# EAGLE design picduino2b (EAGLE 5.06)
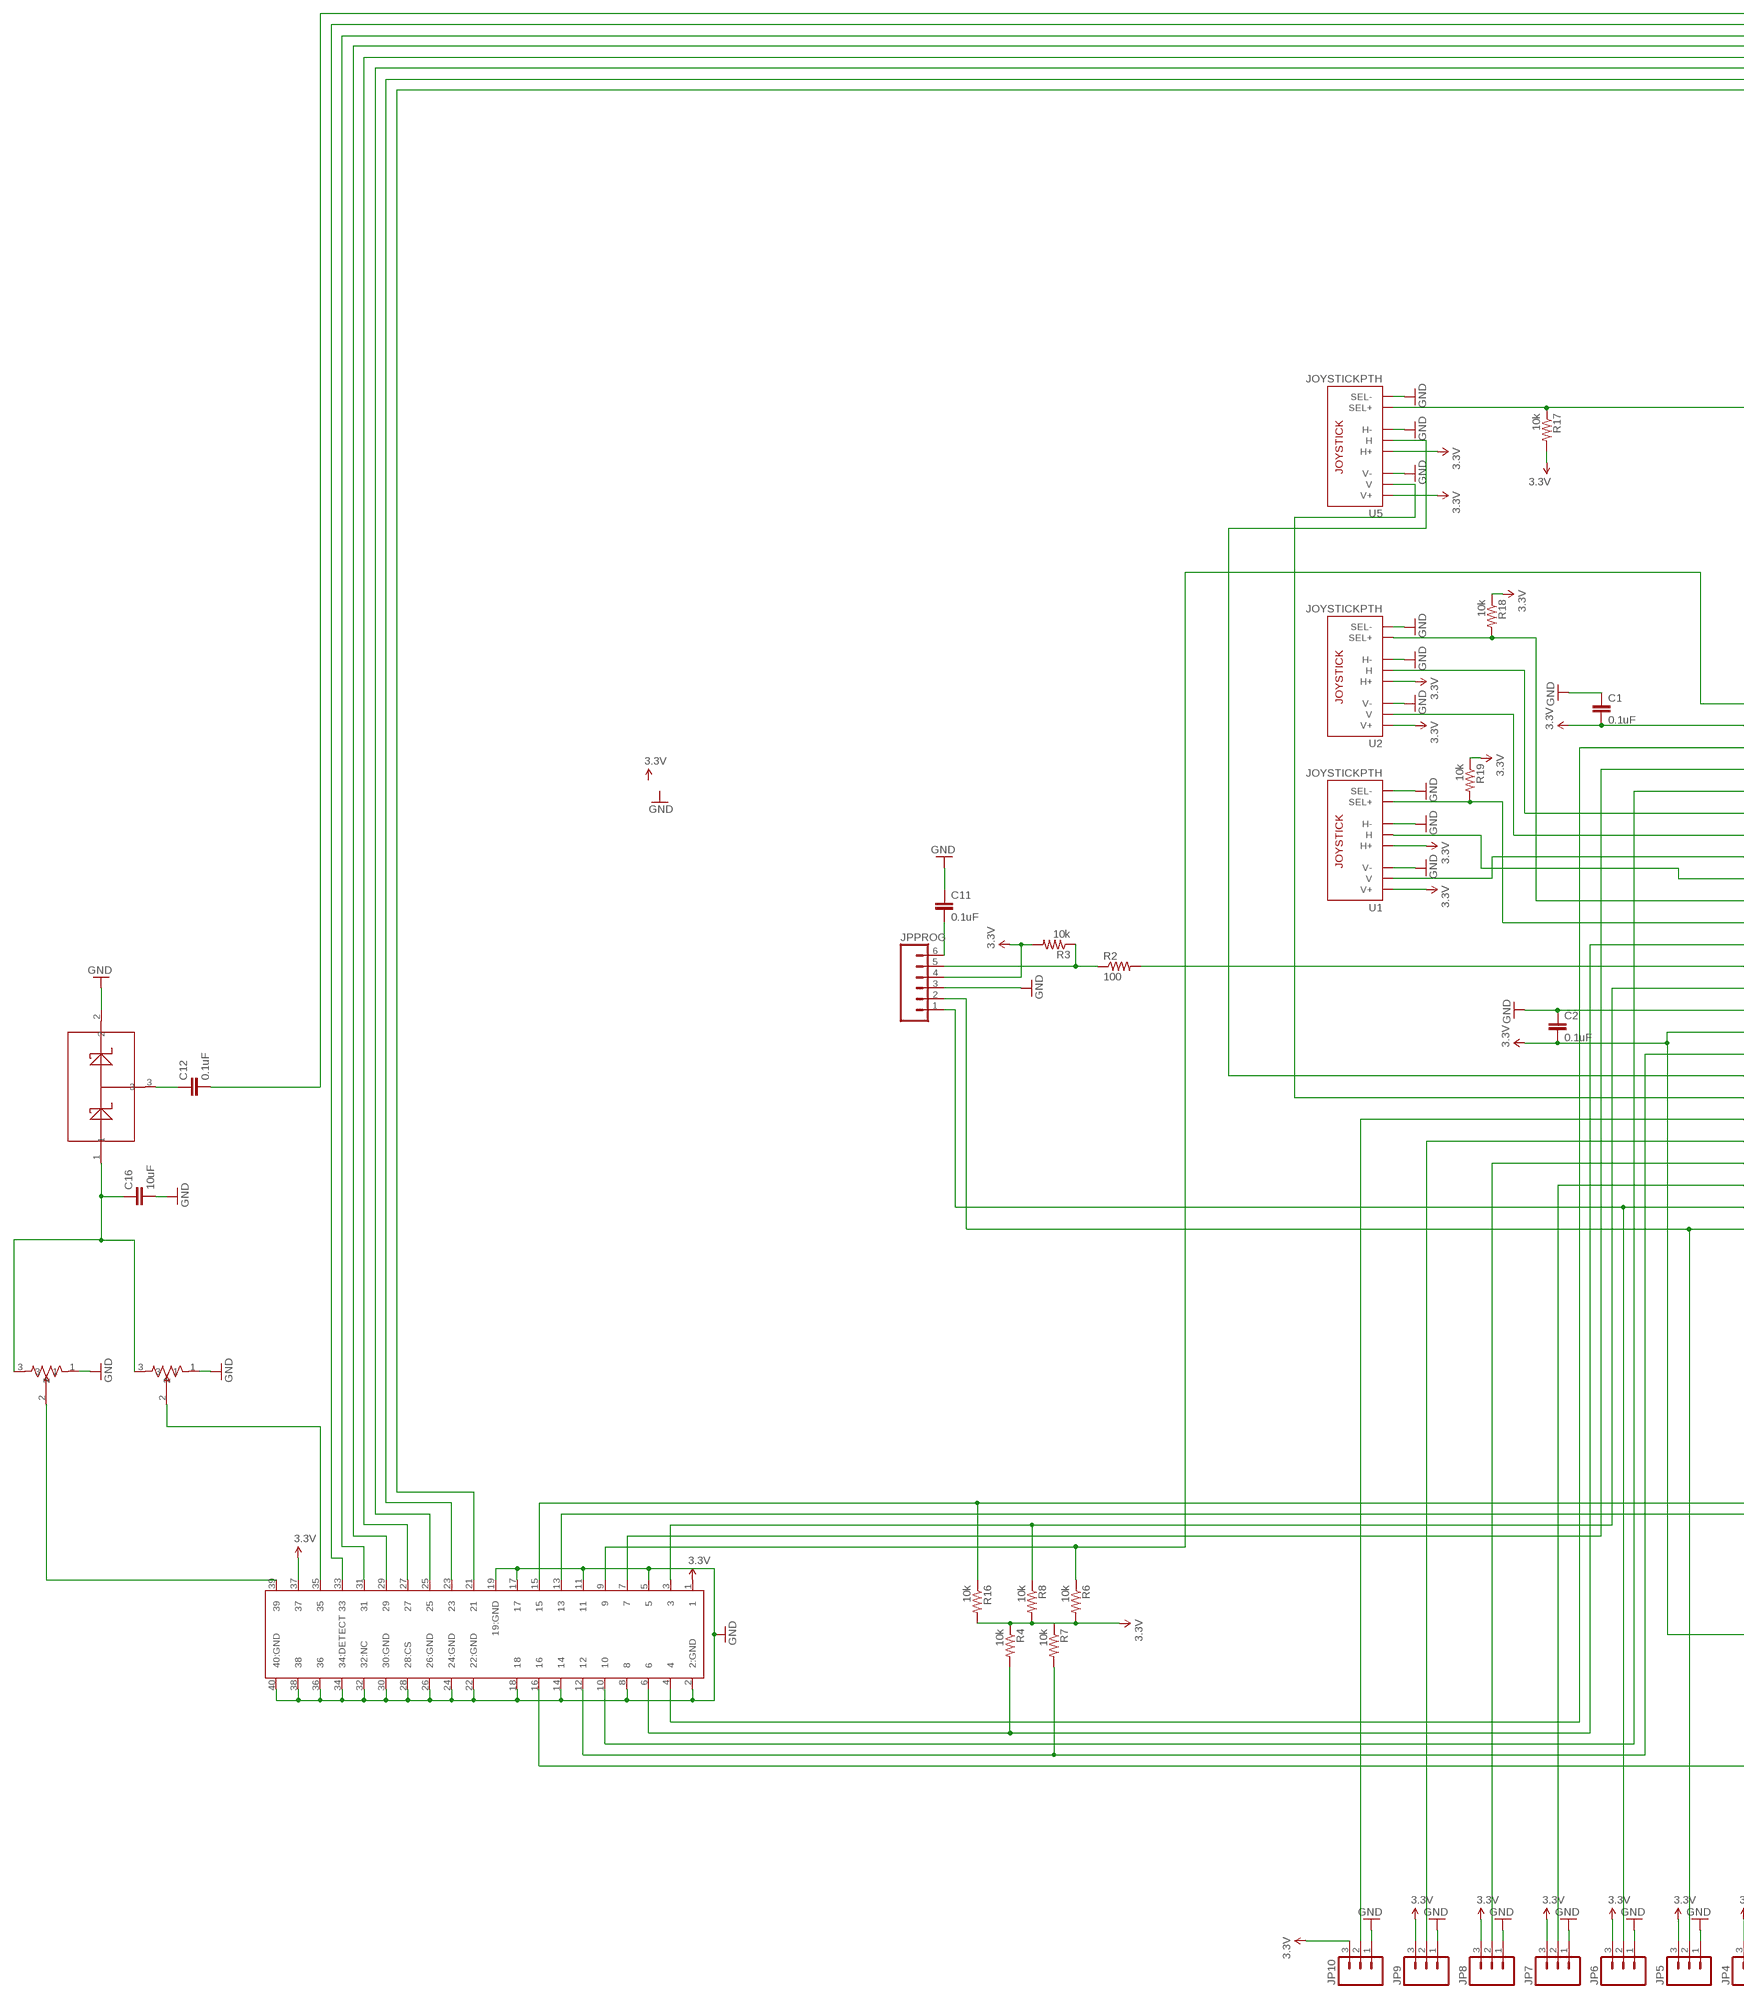
[diagram p0: schematic, sheet 1, part 1 of 2]
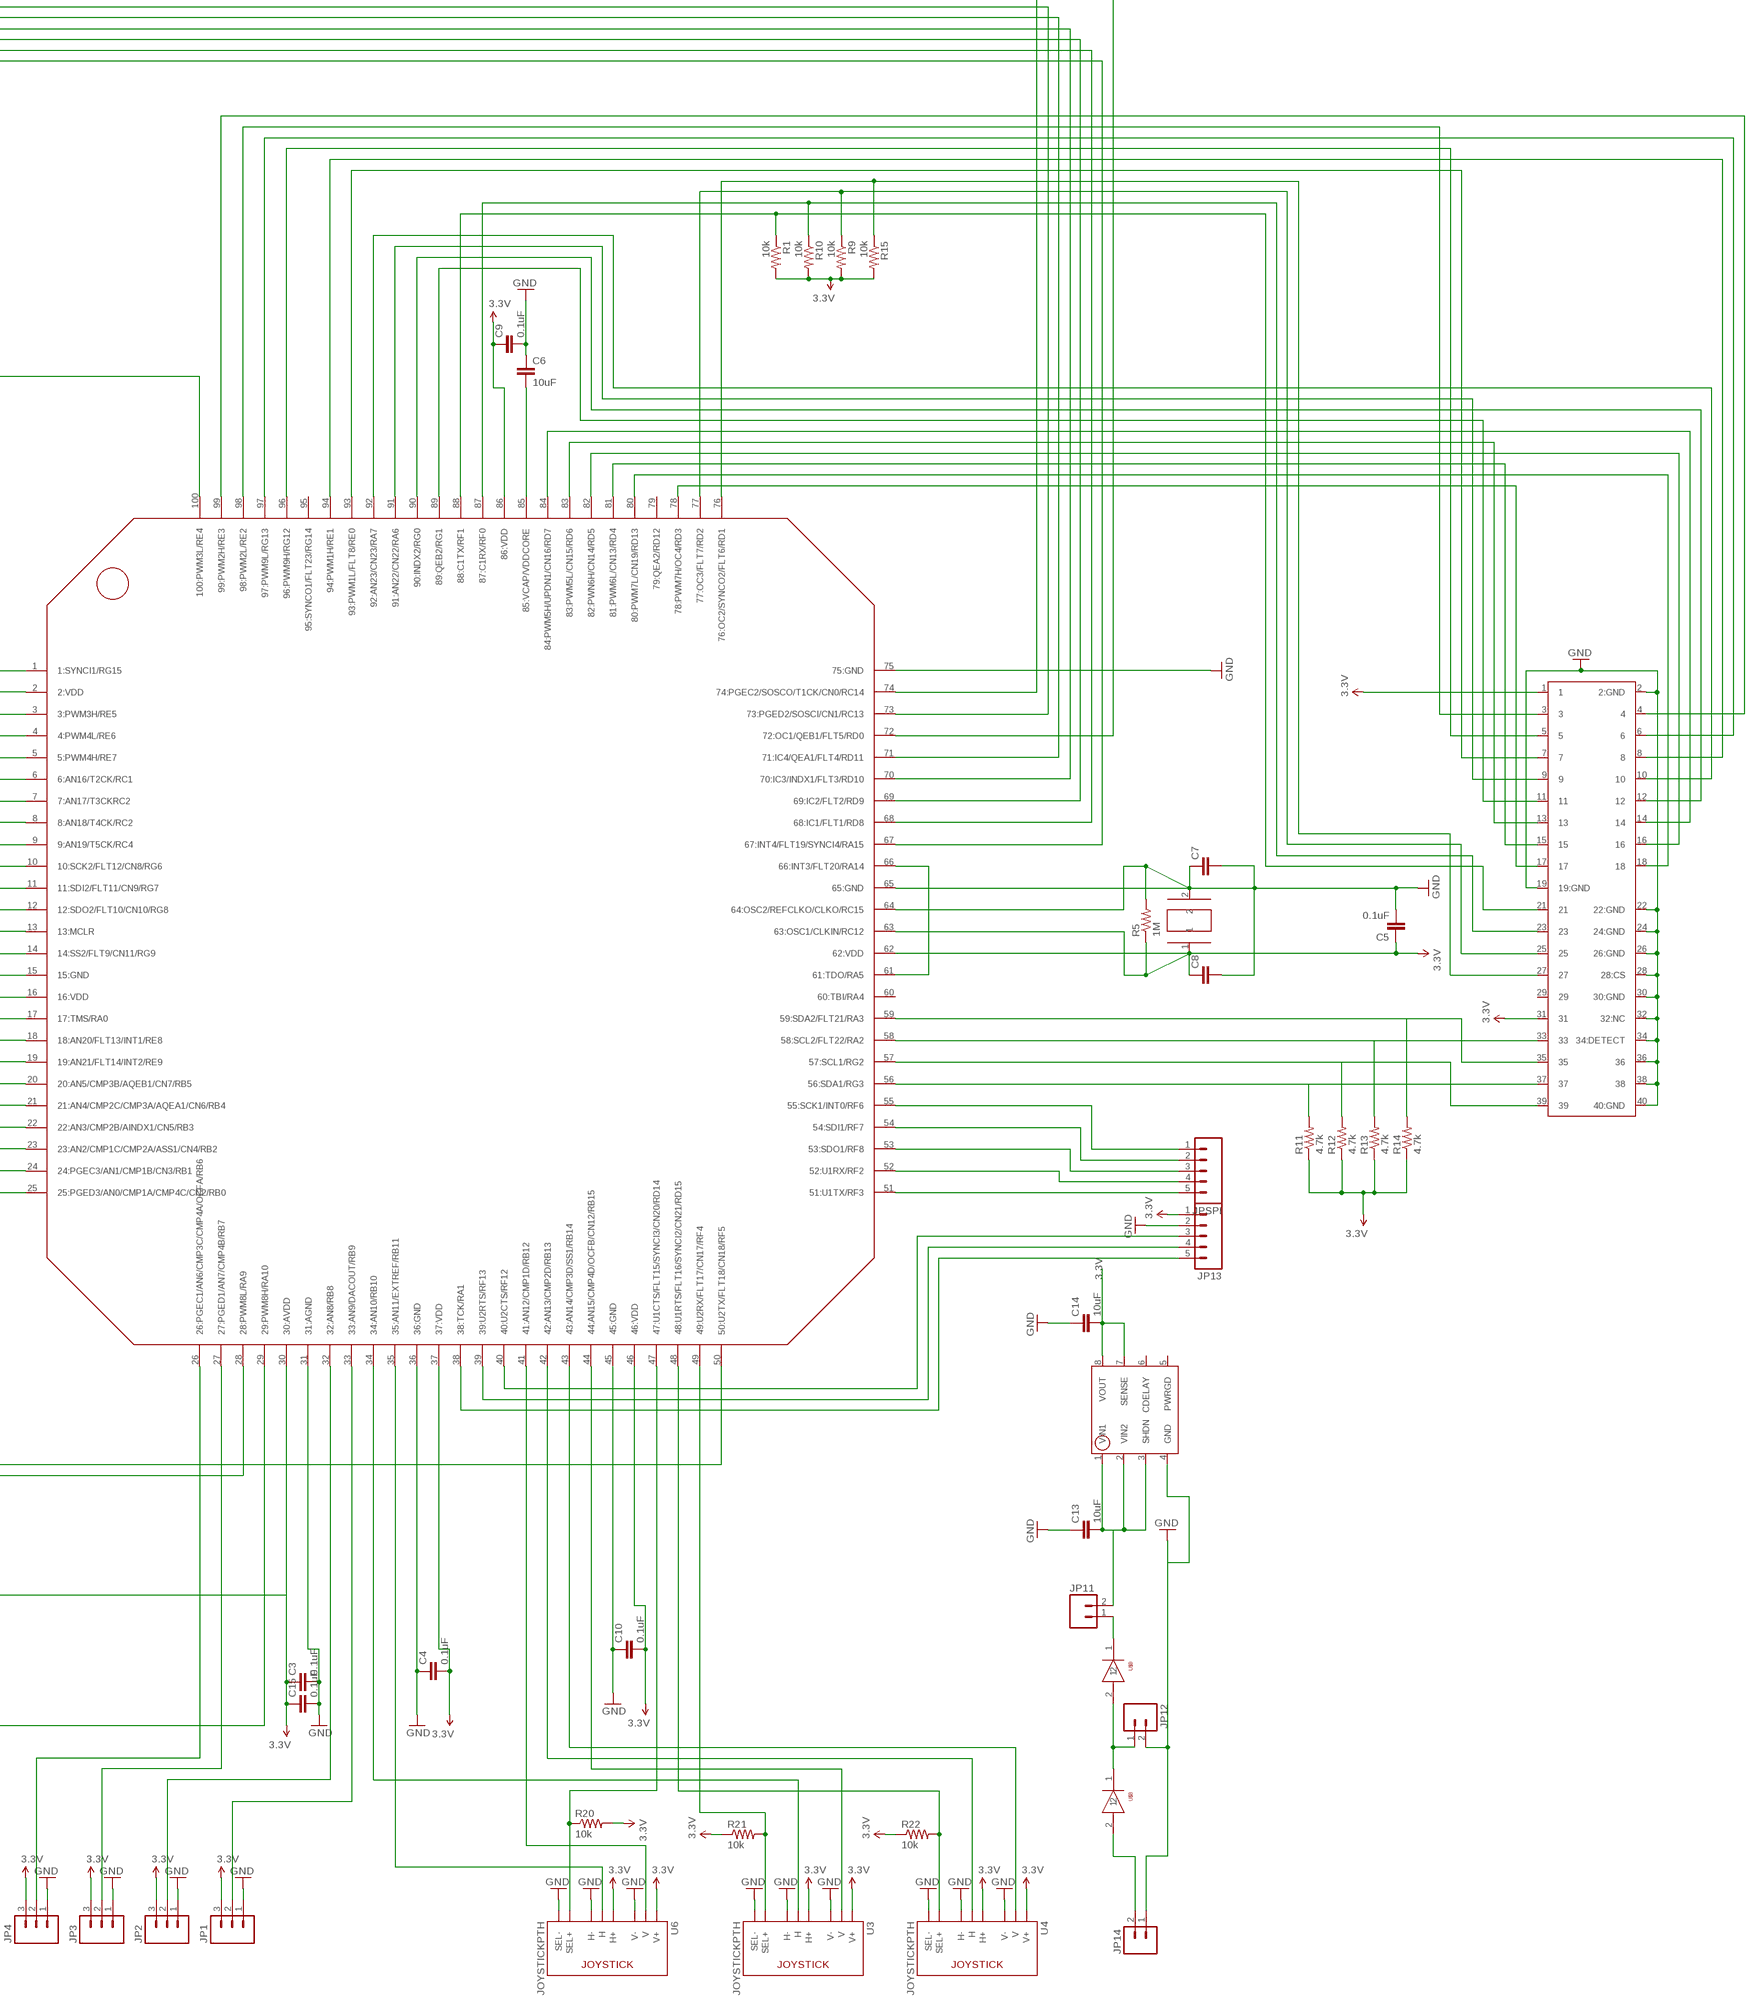
[diagram p1: schematic, sheet 1, part 2 of 2]

## Parts
C1  0.1uF  CAP0805  [0805]
C2  0.1uF  CAP0805  [0805]
C3  0.1uF  CAP0805  [0805]
C4  0.1uF  CAP0805  [0805]
C5  0.1uF  CAP0805  [0805]
C6  10uF  CAP0805  [0805]
C7  CAP0402-CAP  [0402-CAP]
C8  CAP0402-CAP  [0402-CAP]
C9  0.1uF  CAP0805  [0805]
C10  0.1uF  CAP0805  [0805]
C11  0.1uF  CAP0805  [0805]
C12  0.1uF  CAP0805  [0805]
C13  10uF  CAP0805  [0805]
C14  10uF  CAP0805  [0805]
C15  0.1uF  CAP0805  [0805]
C16  10uF  CAP0805  [0805]
JP1  M03LOCK  [1X03_LOCK]
JP2  M03LOCK  [1X03_LOCK]
JP3  M03LOCK  [1X03_LOCK]
JP4  M03LOCK  [1X03_LOCK]
JP5  M03LOCK  [1X03_LOCK]
JP6  M03LOCK  [1X03_LOCK]
JP7  M03LOCK  [1X03_LOCK]
JP8  M03LOCK  [1X03_LOCK]
JP9  M03LOCK  [1X03_LOCK]
JP10  M03LOCK  [1X03_LOCK]
JP11  M02LOCK  [1X02_LOCK]
JP12  M02LOCK  [1X02_LOCK]
JP13  M05LOCK  [1X05_LOCK]
JP14  M02LOCK  [1X02_LOCK]
JPPROG  M06LOCK  [1X06_LOCK]
JPSPI  M05LOCK  [1X05_LOCK]
R1  10k  RESISTOR  [0805]
R2  100  RESISTOR  [0805]
R3  10k  RESISTOR  [0805]
R4  10k  RESISTOR  [0805]
R5  1M  RESISTOR  [0805]
R6  10k  RESISTOR  [0805]
R7  10k  RESISTOR  [0805]
R8  10k  RESISTOR  [0805]
R9  10k  RESISTOR  [0805]
R10  10k  RESISTOR  [0805]
R11  4.7k  RESISTOR  [0805]
R12  4.7k  RESISTOR  [0805]
R13  4.7k  RESISTOR  [0805]
R14  4.7k  RESISTOR  [0805]
R15  10k  RESISTOR  [0805]
R16  10k  RESISTOR  [0805]
R17  10k  RESISTOR  [0805]
R18  10k  RESISTOR  [0805]
R19  10k  RESISTOR  [0805]
R20  10k  RESISTOR  [0805]
R21  10k  RESISTOR  [0805]
R22  10k  RESISTOR  [0805]
U1  JOYSTICKPTH  [JOYSTICK]
U2  JOYSTICKPTH  [JOYSTICK]
U3  JOYSTICKPTH  [JOYSTICK]
U4  JOYSTICKPTH  [JOYSTICK]
U5  JOYSTICKPTH  [JOYSTICK]
U6  JOYSTICKPTH  [JOYSTICK]
U$2  BAS40-04  [SOT23]
U$3  HC49US  [HC49US]
U$4  IDEATTACH  [IDEATTACH]
U$6  PIC33FJGS610-14X14  [TQFP100-14X14]
U$8  NSR0320MW2T1  [SOD-323]
U$9  NSR0320MW2T1  [SOD-323]
U$10  TRIMPOT3319  [TRIMPOT3319]
U$11  TRIMPOT3319  [TRIMPOT3319]
U$12  IDEATTACH  [IDEATTACH]
U$16  MCP1725  [SOIC8]

## Nets
3.3V: C1.2 C2.2 C3.1 C4.2 C5.1 C9.1 C10.2 C14.2 C15.1 JP1.3 JP2.3 JP3.3 JP4.3 JP5.3 JP6.3 JP7.3 JP8.3 JP9.3 JP10.3 JP13.1 JPPROG.4 R1.2 R3.2 R4.1 R6.2 R7.1 R8.2 R9.2 R10.2 R11.1 R12.1 R13.1 R14.1 R15.2 R16.2 R17.2 R18.1 R19.1 R20.2 R21.1 R22.1 U1.H1(H+) U1.V1(V+) U2.H1(H+) U2.V1(V+) U3.H1(H+) U3.V1(V+) U4.H1(H+) U4.V1(V+) U5.H1(H+) U5.V1(V+) U6.H1(H+) U6.V1(V+) U$4.1 U$4.37 U$6.2(2:VDD) U$6.16(16:VDD) U$6.30(30:AVDD) U$6.37(37:VDD) U$6.46(46:VDD) U$6.62(62:VDD) U$6.86(86:VDD) U$12.1 U$12.31 U$16.7(SENSE) U$16.8(VOUT)
BATTINPUT: JP14.2 U$8.2
CHARGEPUMP: C16.1 U$2.1 U$10.3 U$11.3
CHARGEPUMPPWM: C12.2 U$6.72(72:OC1/QEB1/FLT5/RD0)
GND: C1.1 C2.1 C3.2 C4.1 C5.2 C6.1 C7.2 C8.2 C9.2 C10.1 C11.1 C13.1 C14.1 C15.2 C16.2 JP1.1 JP2.1 JP3.1 JP4.1 JP5.1 JP6.1 JP7.1 JP8.1 JP9.1 JP10.1 JP12.2 JP13.2 JP14.1 JPPROG.3 U1.B2A(SEL-) U1.H3(H-) U1.V3(V-) U2.B2A(SEL-) U2.H3(H-) U2.V3(V-) U3.B2A(SEL-) U3.H3(H-) U3.V3(V-) U4.B2A(SEL-) U4.H3(H-) U4.V3(V-) U5.B2A(SEL-) U5.H3(H-) U5.V3(V-) U6.B2A(SEL-) U6.H3(H-) U6.V3(V-) U$2.2 U$4.2(2:GND) U$4.5 U$4.8 U$4.11 U$4.14 U$4.17 U$4.18 U$4.19(19:GND) U$4.22(22:GND) U$4.24(24:GND) U$4.26(26:GND) U$4.28(28:CS) U$4.30(30:GND) U$4.32(32:NC) U$4.34(34:DETECT) U$4.36 U$4.38 U$4.40(40:GND) U$6.15(15:GND) U$6.31(31:AGND) U$6.36(36:GND) U$6.45(45:GND) U$6.65(65:GND) U$6.75(75:GND) U$10.1 U$11.1 U$12.2(2:GND) U$12.19(19:GND) U$12.22(22:GND) U$12.24(24:GND) U$12.26(26:GND) U$12.28(28:CS) U$12.30(30:GND) U$12.32(32:NC) U$12.34(34:DETECT) U$12.36 U$12.38 U$12.40(40:GND) U$16.4(GND)
HVIN: C13.2 JP11.2 U$16.1(VIN1) U$16.2(VIN2) U$16.3(SHDN)
INT: JPSPI.4 U$6.52(52:U1RX/RF2)
J1S: R22.2 U4.B1A(SEL+) U$6.48(48:U1RTS/FLT16/SYNCI2/CN21/RD15)
J1X: U4.H2(H) U$6.42(42:AN13/CMP2D/RB13)
J1Y: U4.V2(V) U$6.43(43:AN14/CMP3D/SS1/RB14)
J2S: R21.2 U3.B1A(SEL+) U$6.49(49:U2RX/FLT17/CN17/RF4)
J2X: U3.H2(H) U$6.34(34:AN10/RB10)
J2Y: U3.V2(V) U$6.44(44:AN15/CMP4D/OCFB/CN12/RB15)
J3S: R19.2 U1.B1A(SEL+) U$6.11(11:SDI2/FLT11/CN9/RG7)
J3X: U1.V2(V) U$6.8(8:AN18/T4CK/RC2)
J4S: R18.2 U2.B1A(SEL+) U$6.10(10:SCK2/FLT12/CN8/RG6)
J4X: U2.H2(H) U$6.6(6:AN16/T2CK/RC1)
J4Y: U2.V2(V) U$6.7(7:AN17/T3CKRC2)
JACKTIEIN: JP12.1 U$8.1 U$9.2
LCDD4: U$4.27 U$6.70(70:IC3/INDX1/FLT3/RD10)
LCDD5: U$4.25 U$6.69(69:IC2/FLT2/RD9)
LCDD6: U$4.23 U$6.68(68:IC1/FLT1/RD8)
LCDD7: U$4.21 U$6.67(67:INT4/FLT19/SYNCI4/RA15)
LCDDRIVE: U$4.35 U$11.2
LCDE: U$4.29 U$6.71(71:IC4/QEA1/FLT4/RD11)
LCDLED: U$4.39 U$10.2
LCDR/W: U$4.31 U$6.73(73:PGED2/SOSCI/CN1/RC13)
LCDRS: U$4.33 U$6.74(74:PGEC2/SOSCO/T1CK/CN0/RC14)
MCLR: R2.2 U$6.13(13:MCLR)
N$1: U$6.78(78:PWM7H/OC4/RD3) U$12.17
N$3: C12.1 U$2.3
N$4: JPPROG.5 R2.1 R3.1
N$5: U$6.80(80:PWM7L/CN19/RD13) U$12.18
N$6: U$6.81(81:PWM6L/CN13/RD4) U$12.15
N$7: R7.2 U$4.12 U$6.17(17:TMS/RA0)
N$9: U$6.82(82:PWN6H/CN14/RD5) U$12.16
N$10: U$4.16 U$6.29(29:PWM8H/RA10)
N$11: U$6.83(83:PWM5L/CN15/RD6) U$12.13
N$12: U$6.84(84:PWM5H/UPDN1/CN16/RD7) U$12.14
N$13: U$4.13 U$6.28(28:PWM8L/RA9)
N$14: R16.1 U$4.15 U$6.50(50:U2TX/FLT18/CN18/RF5)
N$15: U$6.89(89:QEB2/RG1) U$12.11
N$16: U$6.90(90:INDX2/RG0) U$12.12
N$17: U$6.91(91:AN22/CN22/RA6) U$12.9
N$18: U$6.92(92:AN23/CN23/RA7) U$12.10
N$19: U$6.93(93:PWM1L/FLT8/RE0) U$12.7
N$20: U$6.94(94:PWM1H/RE1) U$12.8
N$21: U$6.96(96:PWM9H/RG12) U$12.5
N$23: U$6.97(97:PWM9L/RG13) U$12.6
N$24: U$6.98(98:PWM2L/RE2) U$12.3
N$25: U$6.99(99:PWM2H/RE3) U$12.4
N$26: R17.1 U5.B1A(SEL+) U$6.100(100:PWM3L/RE4)
N$27: R1.1 U$6.88(88:C1TX/RF1) U$12.21
N$28: R10.1 U$6.87(87:C1RX/RF0) U$12.23
N$29: R9.1 U$6.77(77:OC3/FLT7/RD2) U$12.25
N$30: R15.1 U$6.76(76:OC2/SYNCO2/FLT6/RD1) U$12.27
N$31: U1.H2(H) U$6.9(9:AN19/T5CK/RC4)
N$32: R20.1 U6.B1A(SEL+) U$6.47(47:U1CTS/FLT15/SYNCI3/CN20/RD14)
N$33: U$6.61(61:TDO/RA5) U$6.66(66:INT3/FLT20/RA14)
N$35: JP11.1 U$9.1
N$37: JP13.3 U$6.40(40:U2CTS/RF12)
N$38: JP13.4 U$6.39(39:U2RTS/RF13)
N$39: R6.1 U$4.9 U$6.1(1:SYNCI1/RG15)
N$40: U$4.4 U$6.3(3:PWM3H/RE5)
N$41: R4.2 U$4.6 U$6.12(12:SDO2/FLT10/CN10/RG8)
N$42: U$4.7 U$6.4(4:PWM4L/RE6)
N$43: R8.1 U$4.3 U$6.14(14:SS2/FLT9/CN11/RG9)
N$44: U$4.10 U$6.5(5:PWM4H/RE7)
N$45: JP13.5 U$6.38(38:TCK/RA1)
N$59: R11.2 U$6.56(56:SDA1/RG3) U$12.37
N$60: R12.2 U$6.57(57:SCL1/RG2) U$12.39
N$61: R13.2 U$6.58(58:SCL2/FLT22/RA2) U$12.33
N$62: R14.2 U$6.59(59:SDA2/FLT21/RA3) U$12.35
OSC1: C8.1 R5.1 U$3.1 U$6.63(63:OSC1/CLKIN/RC12)
OSC2: C7.1 R5.2 U$3.2 U$6.64(64:OSC2/REFCLKO/CLKO/RC15)
P1: U6.V2(V) U$6.41(41:AN12/CMP1D/RB12)
P2: U6.H2(H) U$6.35(35:AN11/EXTREF/RB11)
P3: JP1.2 U$6.33(33:AN9/DACOUT/RB9)
P4: JP2.2 U$6.32(32:AN8/RB8)
P5: JP3.2 U$6.27(27:PGED1/AN7/CMP4B/RB7)
P6: JP4.2 U$6.26(26:PGEC1/AN6/CMP3C/CMP4A/OCFA/RB6)
P7: JP5.2 JPPROG.2 U$6.25(25:PGED3/AN0/CMP1A/CMP4C/CN2/RB0)
P8: JP6.2 JPPROG.1 U$6.24(24:PGEC3/AN1/CMP1B/CN3/RB1)
P9: JP7.2 U$6.23(23:AN2/CMP1C/CMP2A/ASS1/CN4/RB2)
P10: JP8.2 U$6.22(22:AN3/CMP2B/AINDX1/CN5/RB3)
P11: JP9.2 U$6.21(21:AN4/CMP2C/CMP3A/AQEA1/CN6/RB4)
P12: JP10.2 U$6.20(20:AN5/CMP3B/AQEB1/CN7/RB5)
P13: U5.V2(V) U$6.19(19:AN21/FLT14/INT2/RE9)
P14: U5.H2(H) U$6.18(18:AN20/FLT13/INT1/RE8)
PROGCAP: C11.2 JPPROG.6
RESET: JPSPI.5 U$6.51(51:U1TX/RF3)
SCK: JPSPI.1 U$6.55(55:SCK1/INT0/RF6)
SDI: JPSPI.2 U$6.54(54:SDI1/RF7)
SDO: JPSPI.3 U$6.53(53:SDO1/RF8)
VDDCORE: C6.2 U$6.85(85:VCAP/VDDCORE)
Unconnected: U$6.60(60:TBI/RA4) U$6.79(79:QEA2/RD12) U$6.95(95:SYNCO1/FLT23/RG14) U$12.29 U$16.5(PWRGD) U$16.6(CDELAY)

## Library data of the parts
C1-C16 = SparkFun:CAP: Capacitor Standard 0603 ceramic capacitor, and 0.1" leaded capacitor.
JP1-JP10 = SparkFun:M03: Header 3 Standard 3-pin 0.1" header. Use with straight break away headers (SKU : PRT-00116), right angle break away headers (PRT-00553), swiss pins (PRT-00743), machine pins (PRT-00117), and female headers (PRT-00115). Molex polarized connector foot print use with SKU : PRT-08232 with associated crimp pins and housings.
JP11 JP12 JP14 = SparkFun:M02: Header 2 Standard 2-pin 0.1" header. Use with straight break away headers (SKU : PRT-00116), right angle break away headers (PRT-00553), swiss pins (PRT-00743), machine pins (PRT-00117), and female headers (PRT-00115). Molex polarized connector foot print use with SKU : PRT-08233 with associated crimp pins and housings.
JP13 JPSPI = SparkFun:M05: Header 5 Standard 5-pin 0.1" header. Use with straight break away headers (SKU : PRT-00116), right angle break away headers (PRT-00553), swiss pins (PRT-00743), machine pins (PRT-00117), and female headers (PRT-00115). Molex polarized connector foot print use with SKU : PRT-08230 with associated crimp pins and housings.
JPPROG = SparkFun:M06: Header 6 Standard 6-pin 0.1" header. Use with straight break away headers (SKU : PRT-00116), right angle break away headers (PRT-00553), swiss pins (PRT-00743), machine pins (PRT-00117), and female headers (PRT-00115). Molex polarized connector foot print use with SKU : PRT-08094 with associated crimp pins and housings. NOTES ON THE VARIANTS LOCK and LOCK_LONGPADS... This footprint was designed to help hold the alignment of a through-hole component (i.e. 6-pin header) while soldering it into place. You may notice that each hole has been shifted either up or down by 0.005 of an inch from it's more standard position (which is a perfectly straight line). This slight alteration caused the pins (the squares in the middle) to touch the edges of the holes. Because they are alternating, it causes a "brace" to hold the component in place. 0.005 has proven to be the perfect amount of "off-center" position when using our standard breakaway headers. Although looks a little odd when you look at the bare footprint, once you have a header in there, the alteration is very hard to notice. Also, if you push a header all the way into place, it is covered up entirely on the bottom side. This idea of altering the position of holes to aid alignment will be further integrated into the Sparkfun Library for other footprints. It can help hold any component with 3 or more connection pins.
R1-R22 = SparkFun:RESISTOR: Resistor Basic schematic elements and footprints for 0603, 1206, and PTH 1/10th watt (small) resistors.
U1-U6 = SparkFun:JOYSTICK: Thumb Joystick Joystick commonly found in PS2 controllers. Two pots and a select switch. Footprint proven. Spark Fun Electronics SKU : COM-09032
U$2 = 1dah:BAS40-04: 2 Schottky diodes
U$3 = 1dah:HC49US: 16 MHz crystal
U$4 U$12 = 1dah:IDEATTACH
U$6 = 1dah:PIC33FJGS610-14X14
U$8 U$9 = 1dah:NSR0320MW2T1: 1A Schottky diode
U$10 U$11 = 1dah:TRIMPOT3319: Bournes Trimpot
U$16 = 1dah:MCP1725: LDO power supply 500mA

## Board
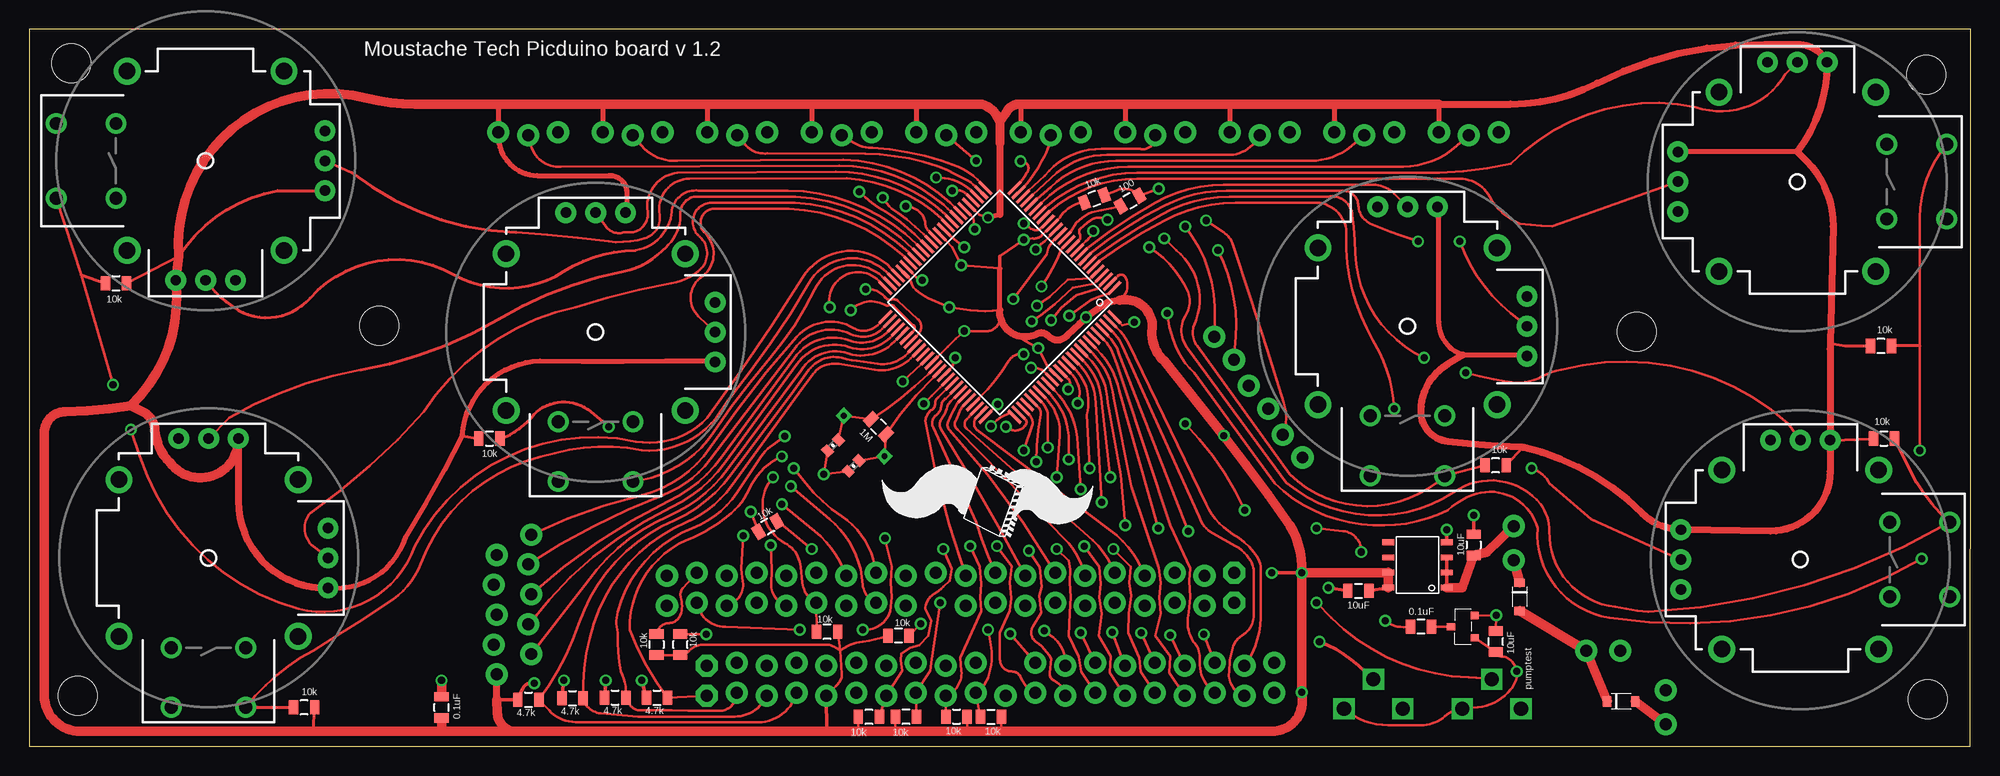
[diagram p2: board, top side]
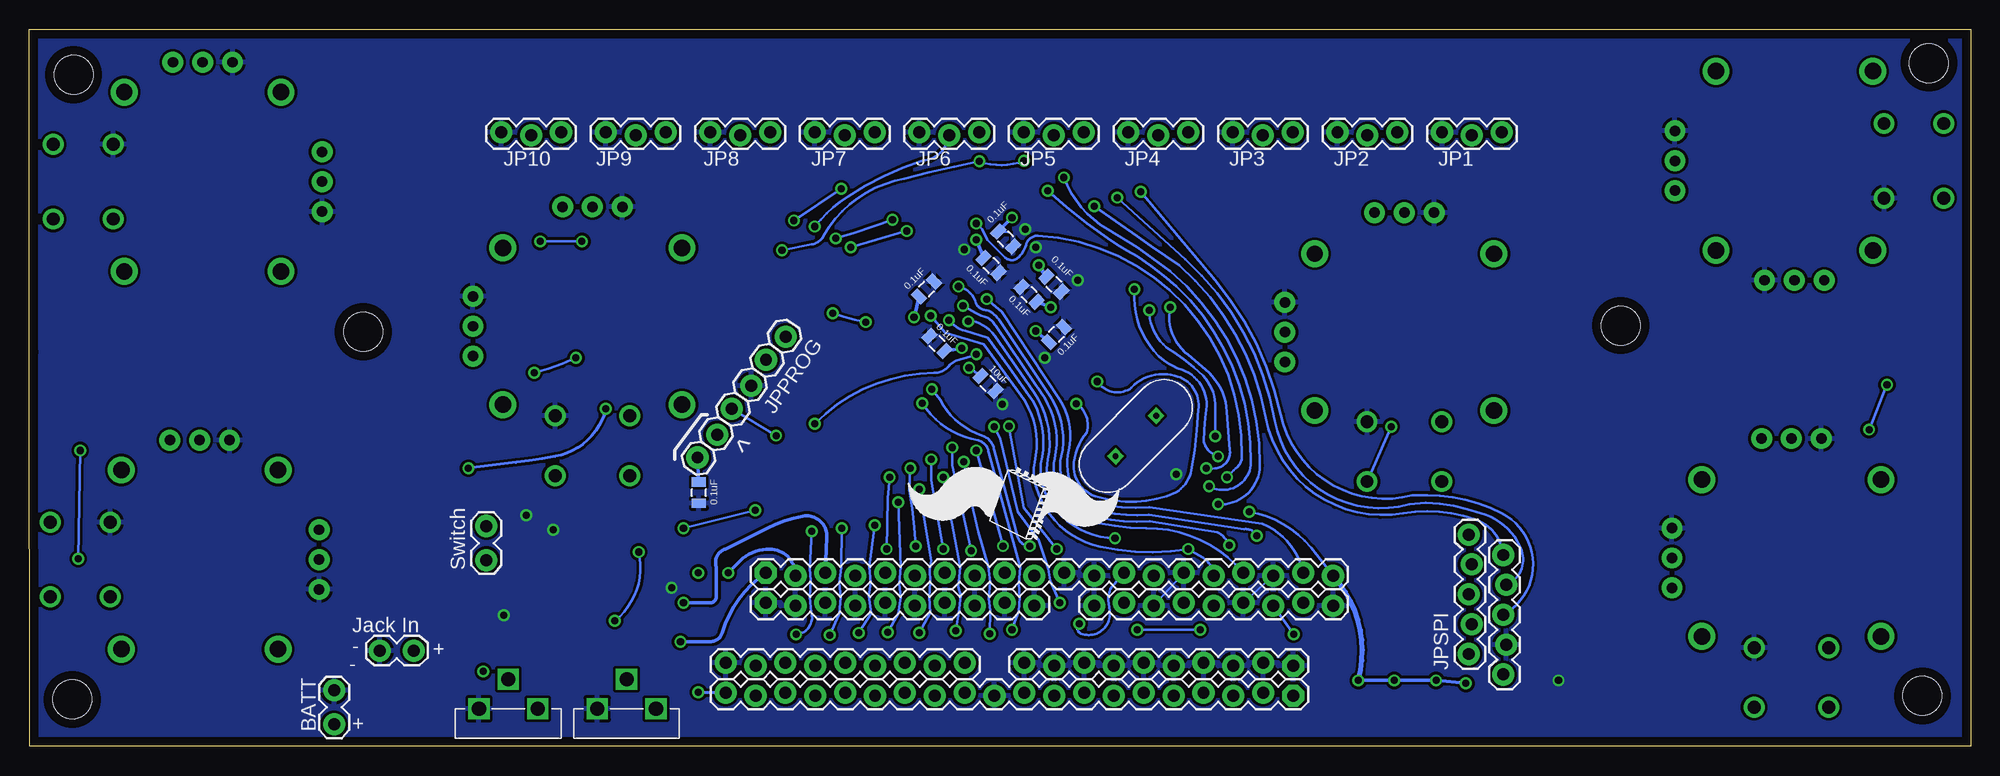
[diagram p3: board, bottom side, seen from below]

Size 165.11 x 60.96 mm. Coordinates in mm from the lower left corner, seen from the top.
Outline: 0,0 165.08,0 165.1,33.53 165.1,60.96 134.11,60.96 17.27,60.96 0,60.96 0,0
Copper layers (1*16): Top 0.035mm / dielectric 1.5mm / Bottom 0.035mm
Design rules "goldenpcb *": minimum track width 9mil, minimum drill 18mil, track to track 9mil, track to pad 8mil, pad to pad 9mil, via to via 9mil, smd to smd 9mil, copper to edge 30mil, drill to drill 9mil, minimum pad ring 10mil, minimum via ring 8mil, stop-mask expansion 4mil, vias tented up to drill 25mil, thermal gap 10mil

### Footprints (pad centres in the part's own frame; a part is rotated, then mirrored left to right if it is on the bottom)
0805 = smd 0.8 x 1.2: 1 -0.9,0; 2 0.9,0
0402-CAP = smd 0.7 x 0.9: 1 -0.65,0; 2 0.65,0
1X03_LOCK = drill 1.016 pad 1.88 round: 1 0,0.127; 2 2.54,-0.127; 3 5.08,0.127
1X02_LOCK = drill 1.016 pad 1.88 round: 1 -0.178,0; 2 2.718,0
1X05_LOCK = drill 1.016 pad 1.88 round: 1 0,0.127; 2 2.54,-0.127; 3 5.08,0.127; 4 7.62,-0.127; 5 10.16,0.127
1X06_LOCK = drill 1.016 pad 1.88 round: 1 0,0; 2 2.54,-0.254; 3 5.08,0; 4 7.62,-0.254; 5 10.16,0; 6 12.7,-0.254
JOYSTICK = drill 1.1 pad 1.778 round: B1A -3.175,12.7; B1B 3.175,12.7; B2A -3.175,7.62; B2B 3.175,7.62 | drill 0.889 pad 1.778 round: H1 -2.54,-10.16; H2 0,-10.16; H3 2.54,-10.16; V1 -10.16,2.54; V2 -10.16,0; V3 -10.16,-2.54 | drill 1.397 pad 2.286 round: MOUNT1 -7.62,6.668; MOUNT2 -7.62,-6.668; MOUNT3 7.62,-6.668; MOUNT4 7.62,6.668
STAND-OFF = hole 3.302: 0,0
SOT23 = smd 0.6 x 0.7: 1 0.95,1; 2 -0.95,1; 3 0,-1
HC49US = drill 0.5 square: 1 -2.44,0; 2 2.44,0
IDEATTACH = drill 1.016 pad 1.88 round: 1 48.26,-0.127; 2 48.26,-2.667; 3 45.72,0.127; 4 45.72,-2.413; 5 43.18,-0.127; 6 43.18,-2.667; 7 40.64,0.127; 8 40.64,-2.413; 9 38.1,-0.127; 10 38.1,-2.667; 11 35.56,0.127; 12 35.56,-2.413; 13 33.02,-0.127; 14 33.02,-2.667; 15 30.48,0.127; 16 30.48,-2.413; 17 27.94,-0.127; 18 27.94,-2.667; 19 25.4,0.127; 21 22.86,-0.127; 22 22.86,-2.667; 23 20.32,0.127; 24 20.32,-2.413; 25 17.78,-0.127; 26 17.78,-2.667; 27 15.24,0.127; 28 15.24,-2.413; 29 12.7,-0.127; 30 12.7,-2.667; 31 10.16,0.127; 32 10.16,-2.413; 33 7.62,-0.127; 34 7.62,-2.667; 35 5.08,0.127; 36 5.08,-2.413; 37 2.54,-0.127; 38 2.54,-2.667 | drill 1.016 pad 1.88 octagon: 39 0,0.127; 40 0,-2.413
TQFP100-14X14 = smd 1.5 x 0.25: 1 -7.75,6; 2 -7.75,5.5; 3 -7.75,5; 4 -7.75,4.5; 5 -7.75,4; 6 -7.75,3.5; 7 -7.75,3; 8 -7.75,2.5; 9 -7.75,2; 10 -7.75,1.5; 11 -7.75,1; 12 -7.75,0.5; 13 -7.75,0; 14 -7.75,-0.5; 15 -7.75,-1; 16 -7.75,-1.5; 17 -7.75,-2; 18 -7.75,-2.5; 19 -7.75,-3; 20 -7.75,-3.5; 21 -7.75,-4; 22 -7.75,-4.5; 23 -7.75,-5; 24 -7.75,-5.5; 25 -7.75,-6; 51 7.75,-6; 52 7.75,-5.5; 53 7.75,-5; 54 7.75,-4.5; 55 7.75,-4; 56 7.75,-3.5; 57 7.75,-3; 58 7.75,-2.5; 59 7.75,-2; 60 7.75,-1.5; 61 7.75,-1; 62 7.75,-0.5; 63 7.75,0; 64 7.75,0.5; 65 7.75,1; 66 7.75,1.5; 67 7.75,2; 68 7.75,2.5; 69 7.75,3; 70 7.75,3.5; 71 7.75,4; 72 7.75,4.5; 73 7.75,5; 74 7.75,5.5; 75 7.75,6 | smd 0.25 x 1.5: 26 -6,-7.75; 27 -5.5,-7.75; 28 -5,-7.75; 29 -4.5,-7.75; 30 -4,-7.75; 31 -3.5,-7.75; 32 -3,-7.75; 33 -2.5,-7.75; 34 -2,-7.75; 35 -1.5,-7.75; 36 -1,-7.75; 37 -0.5,-7.75; 38 0,-7.75; 39 0.5,-7.75; 40 1,-7.75; 41 1.5,-7.75; 42 2,-7.75; 43 2.5,-7.75; 44 3,-7.75; 45 3.5,-7.75; 46 4,-7.75; 47 4.5,-7.75; 48 5,-7.75; 49 5.5,-7.75; 50 6,-7.75; 76 6,7.75; 77 5.5,7.75; 78 5,7.75; 79 4.5,7.75; 80 4,7.75; 81 3.5,7.75; 82 3,7.75; 83 2.5,7.75; 84 2,7.75; 85 1.5,7.75; 86 1,7.75; 87 0.5,7.75; 88 0,7.75; 89 -0.5,7.75; 90 -1,7.75; 91 -1.5,7.75; 92 -2,7.75; 93 -2.5,7.75; 94 -3,7.75; 95 -3.5,7.75; 96 -4,7.75; 97 -4.5,7.75; 98 -5,7.75; 99 -5.5,7.75; 100 -6,7.75
SOD-323 = smd 0.7 x 0.9: 1 -1.2,0; 2 1.2,0
TRIMPOT3319 = drill 1.2 square: 1 -2.5,0; 2 0,2.5; 3 2.5,0
SOIC8 = smd 1 x 0.5: 1 -2.5,1.92; 2 -2.5,0.64; 3 -2.5,-0.64; 4 -2.5,-1.92; 5 2.48,-1.92; 6 2.48,-0.64; 7 2.48,0.64; 8 2.48,1.92

### Placement (x,y rotation side)
C1  88.8,38.88 225 bottom
C2  83.31,40.89 135 bottom
C3  82.07,43.14 315 bottom
C4  77.98,39.29 135 bottom
C5  77.76,35.02 45 bottom
C6  83.57,30.84 135 bottom
C7  70.11,23.83 225 top
C8  68.35,25.59 225 top
C9  87.9,34.23 135 bottom
C10  80.08,38.43 315 bottom
C11  108.17,21.55 90 bottom
C12  118.36,10.16 180 top
C13  122.83,17.12 270 top
C14  113.03,13.21 0 top
C15  35.05,3.3 90 top
C16  124.71,8.89 90 top
JP1  44.96,52.07 0 bottom
JP2  53.85,52.07 0 bottom
JP3  62.74,52.07 0 bottom
JP4  71.63,52.07 0 bottom
JP5  80.52,52.07 0 bottom
JP6  89.41,52.07 0 bottom
JP7  98.3,52.07 0 bottom
JP8  107.19,52.07 0 bottom
JP9  116.08,52.07 0 bottom
JP10  124.97,52.07 0 bottom
JP11  126.24,16 90 bottom
JP12  132.59,8.13 180 bottom
JP13  39.62,6.1 90 bottom
JP14  139.19,4.57 270 bottom
JPPROG  100.79,34.81 235 bottom
JPSPI  42.57,7.83 90 bottom
R1  81.79,2.49 0 top
R2  93.61,46.38 210 top
R3  90.58,46.56 200 top
R4  55.37,8.64 90 top
R5  72.22,27.16 315 top
R6  62.8,18.68 210 top
R7  67.86,9.73 180 top
R8  53.34,8.64 270 top
R9  74.56,2.49 180 top
R10  78.86,2.51 0 top
R11  49.83,4.13 0 top
R12  53.37,4.12 0 top
R13  42.44,3.95 0 top
R14  46.2,4.07 0 top
R15  71.4,2.49 180 top
R16  73.91,9.4 180 top
R17  157.48,34.04 180 top
R18  157.73,26.16 0 top
R19  124.71,23.88 180 top
R20  7.37,39.37 0 top
R21  39.12,26.16 0 top
R22  23.37,3.3 180 top
U1  117.22,35.71 180 top
U2  150.62,15.86 270 top
U3  48.16,35.21 180 top
U4  15.24,16 180 top
U5  150.37,48.01 270 top
U6  14.99,49.78 90 top
U$1  [STAND-OFF]  4.1,4.27 0 top
U$2  121.92,10.16 270 top
U$3  71,26.38 225 bottom
U$4  102.49,14.61 0 bottom
U$5  [STAND-OFF]  3.54,58.1 0 top
U$6  82.55,37.74 225 top
U$7  [STAND-OFF]  161.35,57.1 0 top
U$8  135.38,3.81 0 top
U$9  126.75,12.7 270 top
U$10  114.31,3.18 0 bottom
U$11  124.37,3.18 0 bottom
U$12  57.62,4.42 180 bottom
U$13  [STAND-OFF]  29.75,35.77 0 top
U$14  [STAND-OFF]  161.46,3.97 0 top
U$15  [STAND-OFF]  136.71,35.25 0 top
U$16  118.05,15.41 180 top
U$17  [MTECHLOGO1]  82,20.64 0 top
U$18  [MTECHLOGO1]  80.88,20.42 0 bottom

### Tracks (layer width: path | path; a pad name or v marks a point on that pad's centre or on a via)
3.3V  (via drill 0.6)
  Top 0.229: v81.53,44.96 80.77,45.21 U$6.30 | 82.55,41.66 v84.58,43.06 arc1 85.34,43.18 arc52 86.11,43.43 U$6.16 arc3 87.63,44.96 arc-51 R3.2 | U$6.37 78.49,42.42 v79.25,40.89 82.55,40.64 | U$6.46 74.83,39.8 arc-11 75.16,39.04 arc22 76.45,38.1 arc3 v78.23,37.34 80.01,37.08 arc16 82.55,37.08 | U$6.86 86.61,32.26 v85.8,33.86 arc-10 82.78,35.79 arc-53 82.55,36.58 arc-90 81.53,35.31 v79.5,35.31 arc1 77.42,33.3 U$6.62 | U$12.31 68.58,5.08 arc47 69.11,6.12 68.96,8.15 | 68.96,8.15 R7.1 | 70.48,1.27 R15.2 | 73.66,1.27 R9.2 | 79.76,1.27 R10.2 | 82.68,1.27 R1.2 | v61.34,19.94 R6.2 | U$6.2 92.56,39.98 arc-109 93.22,39.88 arc-81 92.73,37.92 | R8.2 R4.1 arc33 56.13,8.13 arc-44 57.4,8.64 67.56,8.64 arc-34 68.58,8.38 68.96,8.15 | 68.96,8.15 69.34,8.38 arc-25 70.87,8.89 arc15 R16.2 | 12.7,41.66 R20.2
  Top 0.254: 24.13,1.27 R22.1 | R17.2 154.43,34.04 153.17,34.27 | U2.V1 R18.1 | U6.H1 21.08,47.24 arc46 12.7,41.66 | 36.83,26.42 R21.1 | 127,25.4 R19.1
  Top 0.305: 82.55,40.64 82.55,41.66 | v108.2,14.73 v105.66,14.73 | 39.75,3.97 R13.1 41.91,4.83 arc-81 v42.93,5.33 | v45.47,5.59 R14.1 | v49.02,5.59 R11.1 | v52.07,5.59 R12.1 | 67.82,1.27 U$12.31 | U$16.8 C14.2
  Top 0.406: 48.77,54.61 JP2.3 | 57.66,54.61 JP3.3 | 66.55,54.61 JP4.3 | 75.44,54.61 JP5.3 | 84.33,54.61 JP6.3 | 93.22,54.61 JP7.3 | 102.11,54.61 JP8.3 | 111,54.61 JP9.3 | 119.89,54.61 JP10.3 | U3.H1 50.8,45.37 50.8,47.24 arc90 49.28,48.51 43.18,48.51 arc-92 JP1.3 39.88,54.61 | U3.V1 58.17,32.67 58.17,32.77 54.1,32.77 arc-2 43.43,32.77 arc85 36.83,26.42 arc-5 32,17.78 arc-78 U4.V1 | U1.H1 119.89,45.87 119.89,36.07 arc72 121.92,33.27 127,33.27 127,33.17 U1.V1 | 150.37,50.55 U5.H1 | 82.55,45.21 v81.53,44.96 | 82.55,37.08 82.55,40.64
  Top 0.61: U4.H1 17.78,20.83 arc92 U4.V1 | 121.92,33.27 120.65,32.51 arc59 118.36,28.45 arc83 120.65,25.91 arc4 127,25.4 arc-33 137.16,19.81 arc44 U2.H1 148.08,18.29 arc90 153.16,23.37 U2.V1 153.16,33.78 153.17,34.27 153.42,44.2 arc46 151.13,49.78 150.37,50.55 arc37 U5.V1 arc64 150.37,59.69 arc-2 147.57,59.69 arc28 133.35,56.39 arc-27 125.98,54.61 119.89,54.61 | 82.55,36.68 82.55,36.58 | 82.55,36.68 82.55,37.08 | 92.73,37.92 91.62,37.69 v89.86,36.47 arc-1 88.24,34.9 arc-93 86.72,34.82 arc70 85.8,35.1 arc-113 82.55,36.68 | 82.55,51.31 82.55,45.21 | 39.75,3.97 JP13.1
  Top 0.762: 82.55,53.09 82.55,51.31
  Top 0.813: 48.77,54.61 39.88,54.61 32.77,54.61 arc-14 28.7,55.12 arc109 12.7,41.66 U6.V1 arc-53 8.64,28.96 | 48.77,54.61 49.02,54.61 | 48.77,54.61 57.66,54.61 66.55,54.61 75.44,54.61 81.03,54.61 arc-53 82.55,53.09 83.06,53.85 arc-67 84.33,54.61 93.22,54.61 102.11,54.61 111,54.61 119.89,54.61 | U4.H1 arc-145 11.94,24.13 arc-41 10.67,26.92 arc59 9.65,28.45 8.64,28.96 | 92.73,37.92 arc-106 95.5,35.56 arc57 96.52,32.77 v101.6,26.42 arc-2 107.19,18.8 arc-36 v108.2,14.73 | v108.2,14.73 v108.2,4.57 arc-18 108.2,3.3 arc-81 105.66,1.27 82.68,1.27 79.76,1.27 73.66,1.27 70.48,1.27 67.82,1.27 40.51,1.27 | 39.75,3.97 39.8,2.79 arc77 41.17,1.25 40.51,1.27 | v108.2,14.73 115.57,14.73 | 115.57,14.73 U$16.8 | 115.57,14.73 U$16.7 | 35.05,1.27 24.13,1.27 4.32,1.27 arc-95 1.27,4.57 1.27,26.67 arc-90 3.05,28.45 arc10 8.64,28.96 | 35.05,1.27 40.51,1.27 | 35.05,1.27 C15.1
  Bottom 0.229: C3.1 81.79,43.69 | v101.6,26.42 JPPROG.4 | U$4.1 55.63,16.26 arc-45 v61.34,19.94
  Bottom 0.305: v84.58,43.06 C2.2 | v79.25,40.89 C4.2 | v89.86,36.47 C1.2 | v78.23,37.34 C10.2 | v85.8,33.86 C9.1 | v79.5,35.31 C5.1 | v81.53,44.96 C3.1 | v108.2,4.57 U$12.1 | v42.93,5.33 v45.47,5.59 v49.02,5.59 v52.07,5.59 | v105.66,14.73 104.65,15.75 arc46 102.11,16.76 arc90 U$4.37
  Bottom 0.406: v52.07,5.59 arc-58 U$4.1
BATTINPUT
  Top 0.813: JP14.2 U$8.2
CHARGEPUMP  (via drill 0.6)
  Top 0.229: U$2.1 C16.1 arc83 125.48,7.62 arc-60 v126.49,6.35 126.49,5.84 arc-28 125.98,4.83 arc-47 123.19,3.3 U$11.3 arc36 120.4,2.54 arc-42 118.36,1.78 arc1 115.57,1.78 arc-42 U$10.3
CHARGEPUMPPWM  (via drill 0.6)
  Top 0.229: U$6.72 80.8,29.62 arc13 83.31,32.77 arc-76 v84.56,33.33 | v98.3,27.43 arc-20 v103.38,20.07 | v109.47,18.54 111.76,18.29 arc-86 v113.28,16.51 | v115.32,10.67 arc18 116.33,10.16 arc14 C12.2
  Bottom 0.229: v84.56,33.33 arc6 85.88,32.92 arc-37 86.92,32.31 arc48 88.14,31.75 arc-45 v98.3,27.43 | v103.38,20.07 v109.47,18.54 | v113.28,16.51 arc65 v115.32,10.67
GND  (via drill 0.6)
  Top 0.229: U$6.31 80.26,44.96 v80.39,43.97 | U$6.45 75.44,39.88 v75.95,39.62 | U$6.36 78.23,43.43 v79.5,42.42 | U$6.65 78.49,32.26 v78.74,33.02 | U$6.15 86.36,42.93 arc21 v85.6,42.24 | C8.2 v67.56,23.11 C7.2 | U$6.75 v82.35,29.08 | U$2.2 v124.77,11.12 C16.2
  Top 0.305: U$16.4 v120.55,18.4 | v110.49,13.46 C14.1 | C13.1 v122.83,19.63
  Top 0.813: C15.2 v35.05,5.59
  Bottom 0.229: U$4.8 U$4.5 | U$4.14 U$4.11
  pour Bottom: -12.7,65.79 177.29,65.79 177.29,-12.7 -12.7,-12.7
HVIN
  Top 0.305: U$16.1 U$16.2 U$16.3
  Top 0.813: U$16.1 121.87,13.49 C13.2 123.95,16.51 JP11.2
INT
  Top 0.229: U$6.52 72.52,35.48 arc-71 69.85,35.05 arc82 65.05,33.76 57.91,24.38 arc-32 53.85,21.34 arc13 JPSPI.4
J1S
  Top 0.229: U$6.48 72.92,40.28 arc105 66.29,39.37 arc-8 61.21,31.75 arc4 58.42,27.94 arc-56 52.07,25.15 arc28 44.7,24.89 arc60 33.27,15.49 arc-38 30.48,12.19 arc-2 24.13,8.13 arc24 U4.B1A
  Top 0.254: U4.B1A R22.2
J1X
  Top 0.229: U4.H2 17.02,27.94 arc-20 28.19,32 | 53.85,42.16 arc56 55.37,45.47 arc-88 56.9,46.74 63.75,46.74 arc-47 75.13,42.32 U$6.42
  Top 0.254: 28.19,32 arc20 39.88,36.32 arc-19 50.55,40.39 arc34 53.85,42.16
J1Y
  Top 0.229: U4.V2 24.13,17.02 arc-92 23.88,19.81 arc14 33.53,28.45 arc-45 46.48,37.34 arc-8 54.61,39.37 arc28 56.9,40.39 arc104 56.9,43.43 arc-138 58.17,46.23 63.75,46.23 arc-46 74.78,41.99 U$6.43
J2S  (via drill 0.6)
  Top 0.229: U$6.49 72.54,39.93 arc108 66.8,38.86 arc-15 62.99,33.02 arc7 58.17,26.67 arc-49 U3.B1A
  Top 0.254: v49.28,27.18 47.75,28.45 arc91 42.67,27.94 arc-35 R21.2
  Bottom 0.229: v49.28,27.18 arc2 U3.B1A
J2X
  Top 0.229: U3.H2 49.02,44.2 arc71 50.55,43.69 51.05,43.69 arc99 52.58,45.47 arc-93 55.12,48.77 68.58,48.87 arc-42 77.9,45.24 U$6.34
J2Y
  Top 0.229: U3.V2 56.9,36.58 arc-101 57.15,39.88 arc102 57.4,43.69 arc-138 58.42,45.72 63.25,45.72 arc-45 74.45,41.6 U$6.44
J3S  (via drill 0.6)
  Top 0.229: U$6.11 89.28,43.05 arc78 89.33,43.56 arc-80 89.38,44.02 arc-10 90.27,44.73 arc-63 v91.69,44.78 | v96.52,43.18 97.54,42.16 arc-76 99.06,35.81 arc55 99.31,34.04 107.19,23.11 arc87 U1.B1A R19.2
  Bottom 0.229: v91.69,44.78 arc4 v96.52,43.18
J3X  (via drill 0.6)
  Top 0.229: U1.V2 125.98,36.83 arc-32 v121.67,42.93 | v118.11,42.93 116.59,43.43 arc-7 114.05,44.45 arc-62 113.03,45.97 arc85 111.76,47.24 101.85,47.24 arc27 96.52,45.97 arc12 90.35,41.99 U$6.8
  Bottom 0.229: v118.11,42.93 v121.67,42.93
J4S  (via drill 0.6)
  Top 0.229: U$6.10 89.86,42.93 arc28 v90.47,43.81 | U2.B1A arc-27 137.67,11.43 arc-6 134.9,11.84 arc-85 129.29,18.29 arc36 128.52,20.57 arc87 121.16,21.59 arc-73 106.91,22.4 98.58,33.76 arc-70 98.3,36.58 arc54 98.55,38.61 arc35 v95.25,42.42
  Top 0.254: R18.2 160.02,23.37 arc22 U2.B1A
  Bottom 0.229: v95.25,42.42 v90.47,43.81
J4X  (via drill 0.6)
  Top 0.229: U2.H2 132.84,19.3 129.29,22.35 arc44 v127.76,23.62 | v116.08,28.7 arc25 114.81,33.53 arc-5 113.28,36.58 arc-27 112.01,43.43 arc96 109.22,46.23 102.62,46.23 arc28 96.52,44.7 arc8 91.03,41.27 U$6.6
  Bottom 0.254: v127.76,23.62 123.7,24.13 arc-3 120.4,24.64 arc-66 v116.08,28.7
J4Y  (via drill 0.6)
  Top 0.229: U2.V2 149.61,27.43 arc56 130.3,32 arc19 128.27,31.24 arc-32 125.73,30.99 arc-4 v122.17,31.75 | v118.62,33.02 arc-63 112.78,41.91 arc5 112.52,45.21 arc92 110.49,46.74 102.11,46.74 arc29 96.27,45.21 arc7 90.65,41.6 U$6.7
  Bottom 0.229: v118.62,33.02 arc11 v122.17,31.75
JACKTIEIN
  Top 0.813: U$9.2 JP12.1 U$8.1
LCDD4
  Top 0.229: U$4.27 arc12 78.23,26.92 arc-77 78.21,27.71 arc-5 78.46,28.27 arc-5 78.82,28.98 arc-19 79.12,29.36 arc6 U$6.70
LCDD5
  Top 0.229: U$4.25 arc4 77.52,27 arc-64 77.6,27.86 arc25 78.05,28.85 arc-37 78.38,29.34 U$6.69
LCDD6
  Top 0.229: U$4.23 arc-8 80.52,19.05 76.86,27.13 arc-73 77.06,28.09 arc48 77.57,28.98 arc-54 77.93,29.57 U$6.68
LCDD7
  Top 0.229: U$4.21 arc-10 76.2,27.69 arc-47 76.78,28.63 arc58 77.04,29.13 arc-52 77.29,29.67 U$6.67
LCDDRIVE  (via drill 0.6)
  Top 0.229: v109.47,12.19 110.74,10.92 arc43 122.43,5.84 arc-6 U$11.2
  Bottom 0.305: v109.47,12.19 107.19,12.19 arc-90 106.68,12.7 106.68,15.24 arc90 105.92,16.76 102.36,18.54 arc16 99.31,19.56 arc103 97.28,17.78 arc-1 U$4.35
LCDE
  Top 0.229: U$4.29 arc27 88.39,17.27 78.97,26.92 arc-96 78.79,27.69 arc-3 78.99,28.14 arc4 79.15,28.5 arc-22 79.45,28.98 arc-4 U$6.71
LCDLED  (via drill 0.6)
  Top 0.305: U$10.2 113.03,6.86 arc22 v109.73,8.89
  Bottom 0.305: v109.73,8.89 107.19,8.89 arc-74 106.17,9.65 arc39 U$4.39
LCDR/W
  Top 0.229: U$4.31 arc24 90.42,17.53 79.7,26.98 arc-93 79.76,27.84 arc-6 80.16,28.27 arc3 U$6.73
LCDRS
  Top 0.229: U$4.33 arc27 92.48,17.93 80.75,26.77 arc-97 80.49,27.91 U$6.74
MCLR
  Top 0.229: U$6.13 88.57,43.76 89.05,44.53 arc-22 90.35,45.41 arc-1 R2.2
N$1  (via drill 0.6)
  Top 0.229: U$6.78 85.06,28.14 arc-46 85.34,27.43 v84.58,25.15 | v82.3,17.02 83.54,15.29 83.36,13.92 83.52,12.6 83.39,11.53 82.55,9.65 82.55,7.37 arc90 83.57,6.35 arc-67 84.33,5.84 arc42 U$12.17
  Bottom 0.229: v82.3,17.02 v84.58,25.15
N$3
  Top 0.229: C12.1 U$2.3
N$4  (via drill 0.6)
  Top 0.229: R3.1 92.46,47.24 arc-74 R2.1 v96.06,47.4 | v100.08,44.7 101.6,43.69 arc-39 102.36,42.67 arc-1 106.68,29.21 arc-40 JPPROG.5
  Bottom 0.229: v100.08,44.7 v96.06,47.4
N$5  (via drill 0.6)
  Top 0.229: U$6.80 85.75,28.88 arc-62 86,28.22 arc9 v85.62,24.18 | U$12.18 v83.41,9.55
  Bottom 0.229: v85.62,24.18 arc-9 83.54,15.29 83.36,13.92 83.52,12.6 83.39,11.53 v83.41,9.55
N$6  (via drill 0.6)
  Top 0.229: U$6.81 86.13,29.21 arc-40 86.61,28.19 v86.61,25.4 | v85.01,16.61 85.93,15.21 86.11,13.56 85.9,12.78 86.08,11.33 85.34,10.16 arc85 85.6,8.89 arc-28 86.89,7.44 86.77,6.22 arc69 87.12,5.59 arc-53 U$12.15
  Bottom 0.229: v86.61,25.4 86.61,23.88 v85.01,16.61
N$7  (via drill 0.6)
  Top 0.229: U$6.17 86.06,44.07 arc-70 85.34,43.94 arc-18 v84.58,44.45 | v63.25,22.86 arc103 64.26,17.27 arc-56 65.61,15.24 65.73,13.89 arc56 U$4.12 R7.2
  Bottom 0.229: v84.58,44.45 84.07,43.94 83.62,43.08 82.09,41.55 arc-90 80.97,41.58 arc-28 80.34,42.65 arc73 79.35,43.41 arc88 61.98,24.64 arc50 62.48,23.62 arc-14 v63.25,22.86
N$9  (via drill 0.6)
  Top 0.229: U$6.82 86.49,29.54 arc-48 87.63,26.42 v87.38,22.86 | v86.31,9.8 86.87,9.4 arc-61 U$12.16
  Bottom 0.229: v87.38,22.86 85.93,15.21 86.11,13.56 85.9,12.78 86.08,11.33 v86.31,9.8
N$10  (via drill 0.6)
  Top 0.229: U$6.29 79.68,46.97 arc63 v78.49,47.24 | v64.77,22.1 68.07,19.3 arc-36 70.69,15.06 70.87,13.74 arc57 U$4.16
  Bottom 0.229: v64.77,22.1 arc-118 61.21,24.13 arc-48 67.56,39.12 arc-6 70.87,41.66 arc7 73.41,43.18 arc8 v78.49,47.24
N$11  (via drill 0.6)
  Top 0.229: U$6.83 86.82,29.92 arc-40 88.39,26.42 v88.39,24.38 | v87.38,16.76 88.39,15.75 88.54,15.04 88.49,13.95 88.57,12.68 88.47,11.35 88.39,9.4 89.26,7.62 89.48,6.33 U$12.13
  Bottom 0.229: v88.39,24.38 88.39,22.61 v87.38,16.76
N$12  (via drill 0.6)
  Top 0.229: U$6.84 87.22,30.23 arc-43 89.15,25.65 v89.41,21.84 | U$12.14 v89.41,9.65
  Bottom 0.229: v89.41,21.84 88.39,15.75 88.54,15.04 88.49,13.95 88.57,12.68 88.47,11.35 v89.41,9.65
N$13  (via drill 0.6)
  Top 0.229: U$6.28 80.09,47.27 arc43 v77.11,48.36 | v64.01,20.57 66.8,18.29 arc-31 U$4.13
  Bottom 0.229: v64.01,20.57 arc-93 60.45,23.88 arc-50 68.07,40.39 arc2 70.87,42.42 73.41,43.94 arc38 v77.11,48.36
N$14  (via drill 0.6)
  Top 0.229: U$6.50 72.24,39.57 arc147 v68.07,37.34 | v65.02,23.62 66.04,22.35 arc18 69.09,19.56 arc-50 U$4.15 | R16.1 v75.82,10.41
  Bottom 0.229: v68.07,37.34 arc-65 66.55,33.27 arc7 64.77,31.75 arc42 63.25,28.45 arc-1 62.99,25.15 arc90 64.26,23.62 arc11 v65.02,23.62 | U$4.15 72.9,13.72 arc-46 73.33,12.42 73.23,11.53 arc120 75.69,9.58 arc108 v75.82,10.41
N$15  (via drill 0.6)
  Top 0.229: U$6.89 88.98,32 arc-61 89.92,28.19 v90.17,23.62 | v89.71,16.99 91.01,15.27 91.14,13.82 90.98,12.68 91.19,11.28 90.93,9.4 91.97,7.64 91.87,6.22 U$12.11
  Bottom 0.229: v90.17,23.62 90.27,21.79 arc5 v89.71,16.99
N$16  (via drill 0.6)
  Top 0.229: U$6.90 89.36,32.33 arc-43 90.68,29.21 v91.21,20.75 | U$12.12 v92.1,9.68
  Bottom 0.229: v91.21,20.75 91.01,15.24 91.14,13.82 90.98,12.68 91.19,11.28 v92.1,9.68
N$17  (via drill 0.6)
  Top 0.229: U$6.91 89.69,32.72 arc-43 91.19,29.21 v91.95,22.86 | v92.2,16.76 93.67,15.27 93.55,13.89 93.7,12.8 93.52,11.3 93.47,9.65 94.39,7.52 94.54,6.33 U$12.9
  Bottom 0.229: v91.95,22.86 92.1,21.08 v92.2,16.76
N$18  (via drill 0.6)
  Top 0.229: U$6.92 90.02,33.1 arc-43 91.72,29.21 92.81,23.09 v93.22,18.8 | U$12.10 v94.56,9.63
  Bottom 0.229: v93.22,18.8 93.67,15.27 93.55,13.89 93.7,12.8 93.52,11.3 v94.56,9.63
N$19
  Top 0.229: U$6.93 90.42,33.4 arc-40 92.23,29.59 93.73,22.1 96.06,15.19 96.24,13.89 96.09,12.65 96.22,11.25 95.76,9.4 97.05,7.64 96.95,6.22 U$12.7
N$20  (via drill 0.6)
  Top 0.229: U$6.94 90.78,33.76 arc-33 92.71,30.23 v96.01,18.54 | U$12.8 v97.03,9.45
  Bottom 0.229: v96.01,18.54 96.06,15.19 96.24,13.89 96.09,12.65 96.22,11.25 v97.03,9.45
N$21
  Top 0.229: U$6.96 91.47,34.47 arc-26 92.2,33.27 arc-1 92.99,30.99 97.03,18.8 98.73,15.14 98.65,14.05 98.75,12.65 98.6,11.38 arc48 99.01,8.89 arc-51 99.54,7.16 arc57 U$12.5
N$23  (via drill 0.6)
  Top 0.229: U$6.97 91.82,34.82 arc-30 92.71,33.27 v98.55,18.29 | U$12.6 v99.9,9.5
  Bottom 0.229: v98.55,18.29 98.73,15.14 98.65,14.05 98.75,12.65 98.6,11.38 arc104 v99.9,9.5
N$24
  Top 0.229: U$6.98 92.13,35.23 arc-20 92.96,34.04 99.49,19.51 arc42 100.64,18.11 102.62,17.02 arc-28 103.89,15.75 arc-34 104.14,14.73 104.14,11.18 arc-59 103.12,9.4 arc45 102.36,8.38 102.11,7.29 102.03,6.27 arc79 U$12.3
N$25
  Top 0.229: U$6.99 92.48,35.59 arc-15 93.47,34.29 100.08,20.57 arc33 102.36,18.03 arc-18 104.14,16.51 arc-28 104.72,15.32 104.72,10.92 arc-35 U$12.4
N$26  (via drill 0.6)
  Top 0.229: U$6.100 92.96,35.81 v93.98,36.07 | U5.B1A arc39 160.78,44.96 160.78,34.04 v160.78,25.15 | v160.96,15.93 arc-39 134.37,10.92 arc-85 128.27,18.54 arc97 122.68,21.34 arc24 120.65,20.07 arc-30 114.3,18.8 arc-42 105.92,22.35 99.06,31.75 arc-27 97.28,34.54 arc-13 v96.77,36.83
  Top 0.254: 160.78,34.04 R17.1
  Bottom 0.229: v160.96,15.93 v160.78,25.15 | v96.77,36.83 arc-11 v93.98,36.07
N$27  (via drill 0.6)
  Top 0.229: R1.1 U$12.21 arc36 81.53,5.84 arc30 81.79,8.38 v81.53,9.91 | U$6.88 88.59,31.67 arc-70 v89.15,29.16
  Bottom 0.229: v89.15,29.16 arc-48 84.4,26.01 arc68 83.52,24.97 80.85,15.21 80.97,13.82 80.87,12.65 80.95,11.48 v81.53,9.91
N$28  (via drill 0.6)
  Top 0.229: R10.1 U$12.23 arc75 79.27,6.4 79.17,7.52 80.95,11.46 80.87,12.65 80.97,13.82 80.85,15.24 v80.01,17.02 | U$6.87 88.29,31.29 arc-84 88.44,30.61 v88.34,30.35
  Bottom 0.229: v88.34,30.35 87.63,29.46 arc-46 84.07,26.42 arc67 83.06,25.15 81.03,17.78 arc-75 v80.01,17.02
N$29  (via drill 0.6)
  Top 0.229: R9.1 U$12.25 76.63,6.4 76.73,7.39 v77.47,12.19 | U$6.77 84.71,27.79 arc-75 84.76,27.36 arc-106 v83.06,27.18
  Bottom 0.229: v83.06,27.18 82.55,26.16 81.03,19.94 79.25,17.53 78.44,15.09 78.28,14.07 v77.47,12.19
N$30  (via drill 0.6)
  Top 0.229: R15.1 U$12.27 74.22,6.4 74.09,7.32 74.17,7.87 74.93,8.38 75.69,8.59 76.45,9.4 76.71,10.67 76.2,11.68 arc-56 76.96,12.95 arc12 77.72,13.54 78.28,14.07 78.44,15.09 v77.72,16.76 | U$6.76 83.41,28.37 82.63,27.99 arc22 v81.79,27.2
  Bottom 0.229: v77.72,16.76 80.54,20.27 v81.79,27.2
N$31
  Top 0.229: U1.H2 116.08,46.99 arc43 114.3,47.75 101.6,47.75 arc29 95.76,46.23 arc9 89.99,42.34 arc12 U$6.9
N$32  (via drill 0.6)
  Top 0.229: U$6.47 73.28,40.66 arc104 65.79,39.88 arc-4 57.66,27.94 arc-58 51.56,25.91 arc75 32.77,17.02 arc-86 22.86,11.68 arc-57 9.4,24.64 arc1 v8.64,26.92 | v7.11,30.73 4.4,40.08 U6.B1A
  Top 0.254: 4.4,40.08 R20.1
  Bottom 0.229: v8.64,26.92 v7.11,30.73
N$33  (via drill 0.6)
  Top 0.229: v74.27,31.01 U$6.61 | v76.07,29.13 arc1 U$6.66
  Bottom 0.229: v74.27,31.01 arc-93 71.37,30.48 arc65 67.69,31.5 arc88 65.68,28.6 arc7 66.27,23.44 arc44 67.56,21.59 arc42 74.45,21.26 arc77 76.28,24.13 arc31 75.18,26.67 arc-75 v76.07,29.13
N$35
  Top 0.813: U$9.1 JP11.1
N$37  (via drill 0.6)
  Top 0.229: U$6.40 75.29,43.54 arc14 72.82,45.44 arc-15 v70.59,47.14
  Bottom 0.229: v70.59,47.14 64.26,39.62 arc28 58.67,28.19 arc-92 47.5,21.34 46.23,21.34 arc27 39.88,19.81 arc124 JP13.3
N$38  (via drill 0.6)
  Top 0.229: U$6.39 76.05,43.54 arc11 73.84,45.36 arc-30 v72.59,46.66
  Bottom 0.229: v72.59,46.66 66.8,41.4 arc38 59.18,27.69 arc-95 47.75,20.57 46.33,20.7 arc17 41.66,19.81 arc51 38.35,17.02 arc97 JP13.4
N$39  (via drill 0.6)
  Top 0.229: U$6.1 91.75,38.46 91.08,38.25 90.3,37.95 v88.44,36.6 | v66.55,16.76 65.02,18.03 arc6 R6.1
  Bottom 0.229: v88.44,36.6 87.22,35.18 83.92,34.19 80.75,29.82 arc49 79.6,24.16 arc-24 79.63,22.66 arc-66 74.04,16.97 arc-21 v66.55,16.76 65.28,16 arc57 U$4.9
N$40  (via drill 0.6)
  Top 0.229: U$6.3 90.81,38.91 89.05,38.35 87.78,37.29 v86.89,36.22 | v72.77,17.68 73.33,15.29 73.25,13.95 73.36,12.65 73.23,11.46 arc-78 v70.87,9.91 | v65.53,9.91 59.18,10.16 arc-80 U$4.4
  Bottom 0.229: v86.89,36.22 arc-38 85.52,35.33 83.59,34.72 81.79,32.26 80.01,29.72 arc17 79.25,28.19 arc31 79.07,24 arc-27 78.74,21.61 arc-65 v72.77,17.68 | v65.53,9.91 v70.87,9.91
N$41  (via drill 0.6)
  Top 0.229: U$6.12 87.76,42.24 arc-13 v86.08,39.09 | v60.71,17.91 60.53,15.09 60.68,13.97 arc-84 U$4.6 | R4.2 v57.58,9.53
  Bottom 0.229: v86.08,39.09 arc63 84.61,37.72 arc-72 83.69,37.08 arc35 82.65,36.3 78.28,29.74 arc47 77.34,24.64 arc-88 74.68,20.14 arc-19 69.9,19.68 61.77,18.47 arc66 v60.71,17.91 | v57.58,9.53 U$4.6
N$42  (via drill 0.6)
  Top 0.229: U$6.4 90.53,39.34 88.72,38.99 87.2,37.59 86,36.63 v85.24,36.12
  Bottom 0.229: v85.24,36.12 84.63,36.09 arc27 82.98,34.92 79.63,30.05 arc46 78.49,24.38 arc-85 75.44,19.3 arc-17 70.1,18.54 arc50 U$4.7
N$43  (via drill 0.6)
  Top 0.229: U$6.14 87.05,42.95 arc30 86.51,41.83 v83.67,38.02 | U$4.3 55.58,13.44 arc58 55.4,12.68 arc-37 55.37,11.15 arc-67 54.41,10.46 arc78 R8.1
  Bottom 0.229: v83.67,38.02 82.4,36.96 77.47,29.46 arc46 76.71,25.15 arc-29 76.63,22.61 arc-62 74.52,20.65 arc-16 69.85,20.32 60.25,18.92 arc56 U$4.3
N$44  (via drill 0.6)
  Top 0.229: U$6.5 90.25,39.78 88.32,39.65 86.79,38.23 v85.7,37.47 | v63.07,17.09 63.14,14.96 63.09,13.82 arc74 U$4.10
  Bottom 0.229: v85.7,37.47 84.66,36.85 arc-17 83.59,36.42 arc33 82.93,35.74 79.45,30.66 arc3 78.77,29.62 arc44 77.9,24.43 arc-84 75.29,19.79 arc-23 69.83,19.13 64.08,18.21 arc38 v63.07,17.09
N$45  (via drill 0.6)
  Top 0.229: U$6.38 76.48,43.81 arc-42 76.2,44.45 arc47 75.69,45.47 arc36 v74.52,45.92
  Bottom 0.229: v74.52,45.92 70.87,43.36 arc-4 67.31,40.89 arc38 59.94,27.94 arc-89 48.26,19.81 arc29 42.16,19.3 arc65 JP13.5
N$59  (via drill 0.6)
  Top 0.229: U$6.56 75.21,35.33 arc97 75.18,35.81 73.53,37.44 arc37 72.92,37.44 arc78 v69.85,37.08 | v64.24,26.36 63.25,25.65 arc19 62.23,24.64 60.2,21.59 arc-35 56.39,18.54 arc54 50.04,11.43 arc30 50.04,9.65 arc13 50.29,6.35 arc-35 R11.2 51.05,3.56 arc53 51.82,3.05 arc-3 56.06,3 58.67,3 arc92 U$12.37
  Bottom 0.229: v69.85,37.08 arc-62 67.82,33.53 arc11 65.28,31.5 arc50 64.26,28.45 v64.24,26.36
N$60  (via drill 0.6)
  Top 0.229: U$6.57 75.59,35.03 arc91 75.56,36.32 73.86,37.9 arc49 73.3,37.97 arc-61 72.8,38.15 arc60 v71.12,38.86 | U$12.39 R12.2 arc-16 51.05,9.91 arc-67 55.88,17.53 arc15 57.91,18.54 arc9 59.69,19.81 arc26 61.21,21.84 arc-42 v64.01,24.64
  Bottom 0.229: v71.12,38.86 71.12,38.1 arc-51 68.58,32.77 arc-16 67.06,32 arc71 64.97,28.96 arc-7 65.23,25.91 arc-57 v64.01,24.64
N$61
  Top 0.229: U$6.58 74.7,33.4 arc-54 72.14,32.51 arc-1 70.36,32.77 arc-5 69.09,33.02 arc68 66.29,32 arc1 65.02,30.23 59.69,23.11 arc-30 54.89,19.23 arc48 46.74,10.41 arc-18 R13.2 44.2,3.05 arc49 46.74,2.03 61.98,2.03 arc75 U$12.33
N$62
  Top 0.229: U$6.59 74.98,32.99 arc-54 71.88,32 68.83,32.51 arc67 66.55,31.5 arc-2 65.79,30.48 59.69,22.1 arc-31 55.88,19.05 arc49 48.01,10.41 arc20 R14.2 arc71 48.59,2.79 51.77,2.52 59.99,2.52 arc67 U$12.35
OSC1
  Top 0.229: U$6.63 76.45,31.65 arc-12 R5.1 U$3.1 C8.1
OSC2
  Top 0.229: U$6.64 76.86,31.34 arc11 R5.2 U$3.2 C7.1
P1
  Top 0.229: 51.56,42.16 arc70 54.61,45.21 arc-97 56.9,47.24 64.52,47.24 arc-44 75.49,42.67 U$6.41
  Top 0.254: U6.V2 arc26 17.78,37.08 arc78 23.88,38.1 arc-78 36.07,40.13 arc62 45.47,40.39 arc-32 51.56,42.16
P2
  Top 0.229: U6.H2 27.43,48.77 | 41.4,43.69 arc-3 49.28,42.93 arc23 52.32,43.18 arc83 53.59,45.21 arc-99 56.13,48.26 69.52,48.28 arc-40 77.55,44.88 U$6.35
  Top 0.254: 27.43,48.77 arc36 41.4,43.69
P3
  Top 0.229: JP1.2 42.67,51.05 arc78 45.21,49.28 68.86,49.35 arc-41 77.75,46.02 arc-7 U$6.33
P4
  Top 0.229: JP2.2 52.07,51.05 arc54 55.12,49.78 69.24,49.86 arc-46 U$6.32
P5
  Top 0.229: JP3.2 60.96,51.05 arc52 62.76,50.42 71.09,50.37 arc-19 77.24,49.33 arc-8 79.5,48.26 arc-26 U$6.27
P6
  Top 0.229: JP4.2 70.1,51.31 arc27 71.68,50.88 arc-19 78.99,49.28 arc-28 U$6.26
P7  (via drill 0.6)
  Top 0.229: v80.52,49.78 JP5.2 | v84.3,49.73 arc-140 84.84,48.77 arc-19 U$6.25 | JPPROG.2 102.62,34.8 arc31 v101.09,42.16
  Bottom 0.229: v80.52,49.78 arc41 v84.3,49.73 arc-5 90.68,48.26 arc-50 97.54,43.43 arc51 98.55,42.67 v101.09,42.16
P8  (via drill 0.6)
  Top 0.229: JP6.2 86.87,51.56 arc-19 86.11,49.78 arc-20 U$6.24 | JPPROG.1 100.84,36.32 arc41 v98.3,44.2
  Bottom 0.229: JP6.2 arc76 89.15,49.78 arc-15 95.5,46.74 arc-18 v98.3,44.2
P9
  Top 0.229: JP7.2 95.76,51.82 arc-103 94.49,50.8 91.19,50.8 arc51 86.36,48.51 84.96,47.22 U$6.23
P10
  Top 0.229: JP8.2 104.39,51.56 arc-59 101.85,50.29 91.69,50.29 arc39 87.38,48.77 85.34,46.89 U$6.22
P11
  Top 0.229: JP9.2 112.78,51.31 arc-43 108.97,49.78 92.46,49.78 arc44 86.87,47.55 85.72,46.56 U$6.21
P12
  Top 0.229: JP10.2 121.41,51.05 arc-40 116.84,49.28 93.47,49.28 arc45 86.11,46.23 arc-1 U$6.20
P13
  Top 0.229: U5.V2 149.35,57.15 arc-80 141.73,54.36 arc57 125.98,49.53 arc-15 117.86,48.77 94.23,48.77 arc40 86.56,45.97 arc9 U$6.19
P14
  Top 0.229: U5.H2 129.54,44.2 arc-7 126.75,44.45 arc-39 124.21,46.74 arc61 121.67,48.26 94.23,48.26 arc40 86.82,45.54 arc10 U$6.18
PROGCAP
  Bottom 0.305: C11.2 JPPROG.6
RESET
  Top 0.229: U$6.51 72.14,35.81 arc-75 70.1,35.56 arc79 65.28,34.82 arc7 57.91,25.4 arc-41 52.07,21.34 arc12 JPSPI.5
SCK
  Top 0.229: U$6.55 73.58,34.42 arc-64 69.62,33.4 arc76 65.63,31.98 59.44,23.62 arc-31 54.36,19.56 arc27 48.26,14.99 JPSPI.1
SDI
  Top 0.229: U$6.54 73.2,34.75 arc-64 69.75,33.93 arc74 65.28,32.46 59.18,24.13 arc-28 54.61,20.32 arc23 44.2,12.45 arc-6 JPSPI.2
SDO
  Top 0.229: U$6.53 72.92,35.18 arc-65 69.8,34.49 arc75 65.05,32.99 58.93,24.64 arc-28 54.36,20.83 arc16 JPSPI.3
VDDCORE  (via drill 0.6)
  Top 0.229: U$6.85 86.31,31.85 arc44 v85.19,32.18
  Bottom 0.229: C6.2 arc-3 v85.19,32.18

### Text on the board
tPlace: Moustache Tech Picduino board v 1.2 | pumptest
bPlace: ^ | Switch | Jack In | + | - | - | + | BATT